# Altium project StereoRuler.PrjPcb
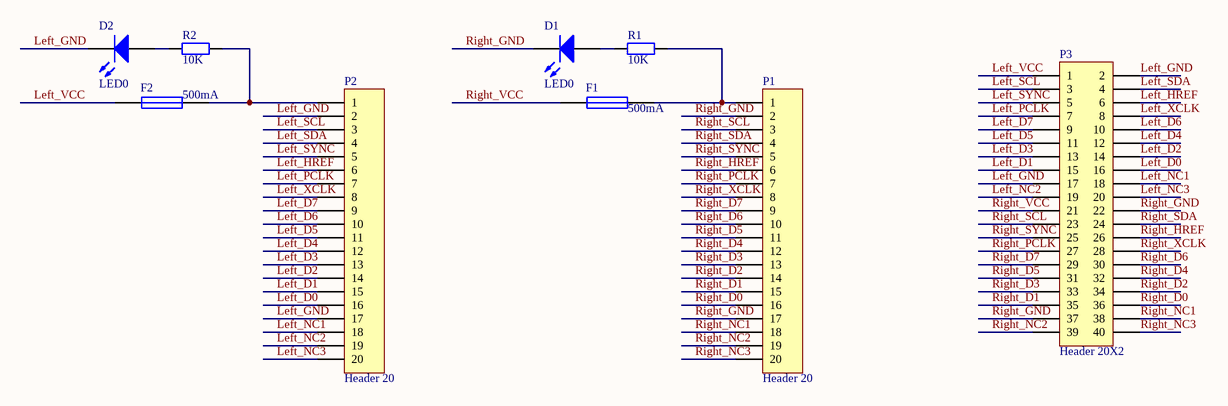
[diagram p0: Sheet1.SchDoc]
1 sheet, 9 parts. Net scope: global (net labels, ports and power ports of the same name join across sheets).
Board file: PCB2.PcbDoc

## Sheet Sheet1.SchDoc
size A4

### Parts
D1  LED0  [LED0805绿]
D2  LED0  [LED0805绿]
F1  500mA  [R0805]
F2  500mA  [R0805]
P1  Header 20  [FPC20Pin]
P2  Header 20  [FPC20Pin]
P3  Header 20X2  [FPC_40pin_05mm]
R1  value 10K  [R0805]  (hidden comment: Res2)
R2  value 10K  [R0805]  (hidden comment: Res2)

### Nets
Left_D0: P2.16 P3.16
Left_D1: P2.15 P3.15
Left_D2: P2.14 P3.14
Left_D3: P2.13 P3.13
Left_D4: P2.12 P3.12
Left_D5: P2.11 P3.11
Left_D6: P2.10 P3.10
Left_D7: P2.9 P3.9
Left_GND: D2.2(K) P2.2 P2.17 P3.2 P3.17
Left_HREF: P2.6 P3.6
Left_NC1: P2.18 P3.18
Left_NC2: P2.19 P3.19
Left_NC3: P2.20 P3.20
Left_PCLK: P2.7 P3.7
Left_SCL: P2.3 P3.3
Left_SDA: P2.4 P3.4
Left_SYNC: P2.5 P3.5
Left_VCC: F2.1 P3.1
Left_XCLK: P2.8 P3.8
Right_D0: P1.16 P3.36
Right_D1: P1.15 P3.35
Right_D2: P1.14 P3.34
Right_D3: P1.13 P3.33
Right_D4: P1.12 P3.32
Right_D5: P1.11 P3.31
Right_D6: P1.10 P3.30
Right_D7: P1.9 P3.29
Right_GND: D1.2(K) P1.2 P1.17 P3.22 P3.37
Right_HREF: P1.6 P3.26
Right_NC1: P1.18 P3.38
Right_NC2: P1.19 P3.39
Right_NC3: P1.20 P3.40
Right_PCLK: P1.7 P3.27
Right_SCL: P1.3 P3.23
Right_SDA: P1.4 P3.24
Right_SYNC: P1.5 P3.25
Right_VCC: F1.1 P3.21
Right_XCLK: P1.8 P3.28
NetD1_1: D1.1(A) R1.2
NetD2_1: D2.1(A) R2.2
NetF1_2: F1.2 P1.1 R1.1
NetF2_2: F2.2 P2.1 R2.1

### Library data of the parts
D1 D2 = LED0: Typical INFRARED GaAs LED; Published: 8-Jun-2000; LatestRevisionDate: 08-Jul-2005; LatestRevisionNote: Mech Layer 1 removed.; PackageReference: LED-0; Publisher: Altium Limited; PackageDescription: LED; 2 Leads
F1 F2 = Fuse 1: Fuse; Published: 8-Jun-2000; LatestRevisionDate: 17-Jul-2002; LatestRevisionNote: Re-released for DXP Platform.; PackageReference: PIN-W2/E2.8; Publisher: Altium Limited; PackageDescription: Thru-Hole; 2 Leads
P1 P2 = Header 20: Header, 20-Pin; LatestRevisionDate: 17-Jul-2002; LatestRevisionNote: Re-released for DXP Platform.; Publisher: Altium Limited
P3 = Header 20X2: Header, 20-Pin, Dual row; LatestRevisionDate: 17-Jul-2002; LatestRevisionNote: Re-released for DXP Platform.; Publisher: Altium Limited
R1 R2 = Res2: Resistor; Published: 8-Jun-2000; LatestRevisionDate: 17-Jul-2002; LatestRevisionNote: Re-released for DXP Platform.; PackageReference: AXIAL-0.4; Publisher: Altium Limited; PackageDescription: Axial Device, Thru-Hole; 2 Leads; 0.4 in Pin Spacing